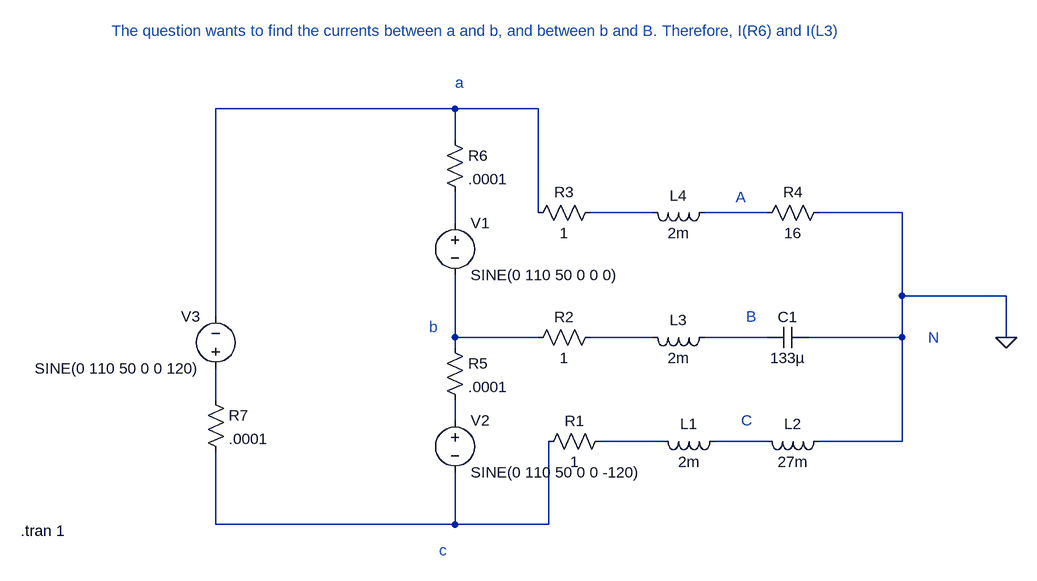
[diagram p0: schematic Draft1.asc]
Draft1.asc, the LTspice schematic file:
Version 4
SHEET 1 1028 680
WIRE 160 -208 -208 -208
WIRE 288 -208 160 -208
WIRE 160 -160 160 -208
WIRE 288 -48 288 -208
WIRE 464 -48 368 -48
WIRE 640 -48 544 -48
WIRE 848 -48 720 -48
WIRE 160 -32 160 -80
WIRE 848 80 848 -48
WIRE 1008 80 848 80
WIRE -208 112 -208 -208
WIRE 160 144 160 48
WIRE 288 144 160 144
WIRE 464 144 368 144
WIRE 640 144 544 144
WIRE 848 144 848 80
WIRE 848 144 704 144
WIRE 1008 144 1008 80
WIRE 160 160 160 144
WIRE -208 240 -208 192
WIRE 160 272 160 240
WIRE 480 304 384 304
WIRE 640 304 560 304
WIRE 848 304 848 144
WIRE 848 304 720 304
WIRE -208 432 -208 320
WIRE 160 432 160 352
WIRE 160 432 -208 432
WIRE 304 432 304 304
WIRE 304 432 160 432
FLAG 1008 144 0
SYMBOL res 400 288 R90
WINDOW 0 0 56 VBottom 2
WINDOW 3 32 56 VTop 2
SYMATTR InstName R1
SYMATTR Value 1
SYMBOL res 384 128 R90
WINDOW 0 0 56 VBottom 2
WINDOW 3 32 56 VTop 2
SYMATTR InstName R2
SYMATTR Value 1
SYMBOL res 384 -64 R90
WINDOW 0 0 56 VBottom 2
WINDOW 3 32 56 VTop 2
SYMATTR InstName R3
SYMATTR Value 1
SYMBOL res 736 -64 R90
WINDOW 0 0 56 VBottom 2
WINDOW 3 32 56 VTop 2
SYMATTR InstName R4
SYMATTR Value 16
SYMBOL ind 576 288 R90
WINDOW 0 5 56 VBottom 2
WINDOW 3 32 56 VTop 2
SYMATTR InstName L1
SYMATTR Value 2m
SYMBOL ind 736 288 R90
WINDOW 0 5 56 VBottom 2
WINDOW 3 32 56 VTop 2
SYMATTR InstName L2
SYMATTR Value 27m
SYMBOL ind 560 128 R90
WINDOW 0 5 56 VBottom 2
WINDOW 3 32 56 VTop 2
SYMATTR InstName L3
SYMATTR Value 2m
SYMBOL ind 560 -64 R90
WINDOW 0 5 56 VBottom 2
WINDOW 3 32 56 VTop 2
SYMATTR InstName L4
SYMATTR Value 2m
SYMBOL cap 704 128 R90
WINDOW 0 0 32 VBottom 2
WINDOW 3 32 32 VTop 2
SYMATTR InstName C1
SYMATTR Value 133µ
SYMBOL voltage 160 -48 R0
WINDOW 123 0 0 Left 0
WINDOW 39 0 0 Left 0
SYMATTR InstName V1
SYMATTR Value SINE(0 110 50 0 0 0)
SYMBOL voltage 160 256 R0
WINDOW 123 0 0 Left 0
WINDOW 39 0 0 Left 0
SYMATTR InstName V2
SYMATTR Value SINE(0 110 50 0 0 -120)
SYMBOL voltage -208 208 R180
WINDOW 0 24 96 Left 2
WINDOW 3 24 16 Left 2
WINDOW 123 0 0 Left 0
WINDOW 39 0 0 Left 0
SYMATTR InstName V3
SYMATTR Value SINE(0 110 50 0 0 120)
SYMBOL res 144 144 R0
SYMATTR InstName R5
SYMATTR Value .0001
SYMBOL res 144 -176 R0
SYMATTR InstName R6
SYMATTR Value .0001
SYMBOL res -224 224 R0
SYMATTR InstName R7
SYMATTR Value .0001
TEXT -508 442 Left 2 !.tran 1
TEXT 888 144 Left 2 ;N
TEXT 160 -248 Left 2 ;a
TEXT 120 128 Left 2 ;b
TEXT 136 472 Left 2 ;c
TEXT 592 -72 Left 2 ;A
TEXT 608 112 Left 2 ;B
TEXT 600 272 Left 2 ;C
TEXT -368 -328 Left 2 ;The question wants to find the currents between a and b, and between b and B. Therefore, I(R6) and I(L3)

The netlist it stands for:
* Draft1.asc
R1 N010 N012 1
R2 N006 N005 1
R3 N002 N001 1
R4 0 N003 16
L1 N011 N010 2m
L2 0 N011 27m
L3 N007 N006 2m
L4 N003 N002 2m
C1 0 N007 133µ
V1 N004 N005 SINE(0 110 50 0 0 0)
V2 N009 N012 SINE(0 110 50 0 0 -120)
V3 N008 N001 SINE(0 110 50 0 0 120)
R5 N005 N009 .0001
R6 N001 N004 .0001
R7 N008 N012 .0001
.tran 1
* N
* a
* b
* c
* A
* B
* C
* The question wants to find the currents between a and b, and between b and B. Therefore, I(R6) and I(L3)
.backanno
.end